# Altium schematic sheet OneWifiGamePad.SchDoc
size A4; PageSetup: Record=PageOptions|CenterHorizontal=True|CenterVertical=True|PrintScale=0.71|XCorrection=1.00|YCorrection=1.00|PrintKind=1|BorderSize=5000000|LeftOffset=0|BottomOffset=0|Orientation=2|PaperLength=1000|PaperWidth=1000|Scale=100|PaperSource=15|PrintQuality=600|MediaType=1|DitherType=10|PaperKind=Statement|PrintScaleMode=1
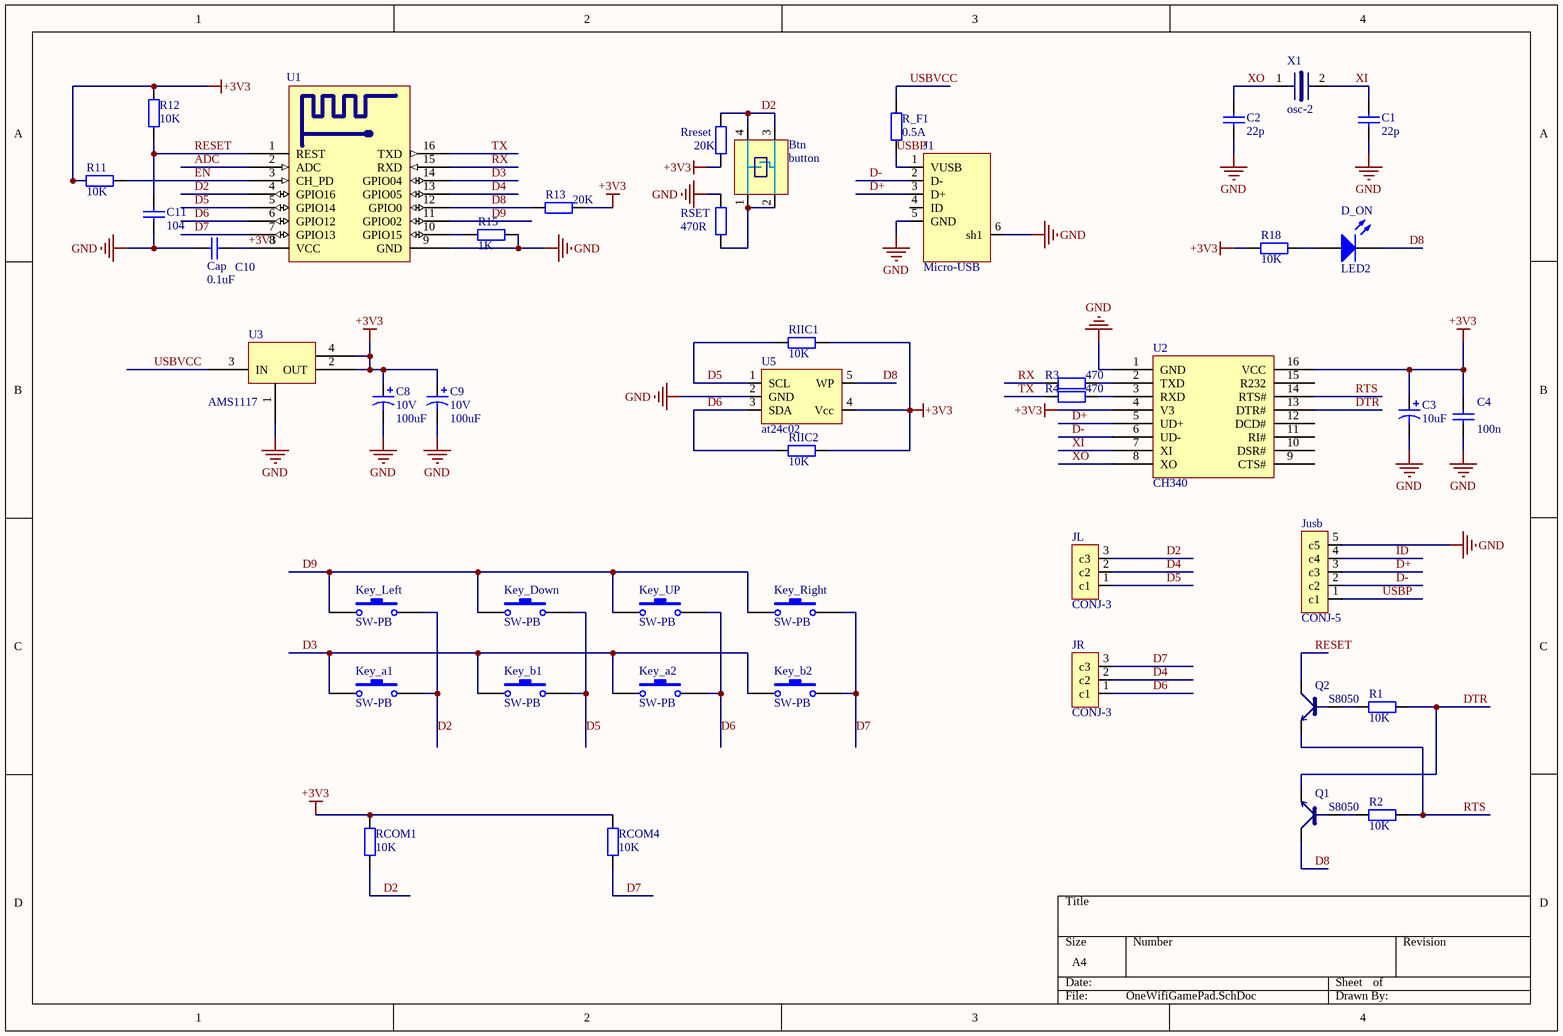
[diagram p0: OneWifiGamePad.SchDoc]

## Parts
Btn  button  [SW_6x6]
C1  22p  [0603]
C2  22p  [0603]
C3  10uF  [smd-ec-f5]
C4  100n  [0603]
C8  10V  value 100uF  [smd-ec-f5]
C9  10V  value 100uF  [smd-ec-f5]
C10  Cap  value 0.1uF  [0603]
C11  104  [0603]
D_ON  LED2  [0603]
J1  Micro-USB  [Micro_USB_B]
JL  CONJ-3  [sip-3]
JR  CONJ-3  [sip-3]
Jusb  CONJ-5  [sip-5]
Key_a1  SW-PB  [gamepad]
Key_a2  SW-PB  [gamepad]
Key_b1  SW-PB  [gamepad]
Key_b2  SW-PB  [gamepad]
Key_Down  SW-PB  [gamepad]
Key_Left  SW-PB  [GamePad]
Key_Right  SW-PB  [gamepad]
Key_UP  SW-PB  [gamepad]
Q1  S8050  [sot23-3]
Q2  S8050  [sot23-3]
R1  10K  [0603]
R2  10K  [0603]
R3  470  [0603]
R4  470  [0603]
R11  10K  [0603]
R12  10K  [0603]
R13  20K  [0603]
R15  1K  [0603]
R18  10K  [0603]
R_F1  0.5A  [0805]
RCOM1  value 10K  [0603]  (hidden comment: Res2)
RCOM4  value 10K  [0603]  (hidden comment: Res2)
RIIC1  10k  [0603]
RIIC2  10k  [0603]
Rreset  value 20K  [0603]  (hidden comment: 10k)
RSET  value 470R  [0603]  (hidden comment: Res2)
U1  ESP-12  [ESP_12]  (value not drawn)
U2  CH340  [SOP127P762-16M]
U3  AMS1117  [SOT-223]
U5  at24c02  [sot-23-5]
X1  osc-2  [RAD-0.2]

## Nets
+3V3: C3.1 C4.2 C8.1 C9.1 C10.1 R11.1 R12.2 R13.2 R18.1 RCOM1.2 RCOM4.2 RIIC1.1 RIIC2.1 Rreset.1 U1.8(VCC) U2.4(V3) U2.16(VCC) U3.2(OUT) U3.4(p4) U5.4(Vcc)
GND: C1.1 C2.1 C3.2 C4.1 C8.2 C9.2 C10.2 C11.1 J1.5(GND) J1.6(sh1) Jusb.5(c5) R15.2 RSET.2 U1.9(GND) U2.1(GND) U3.1(p1) U5.2(GND)
ADC: U1.2(ADC)
D2: Btn.3(b2) Btn.4(a2) JL.3(c3) Key_a1.2 Key_Left.2 RCOM1.1 Rreset.2 U1.4(GPIO16)
D3: Key_a1.1 Key_a2.1 Key_b1.1 Key_b2.1 U1.14(GPIO04)
D4: JL.2(c2) JR.2(c2) U1.13(GPIO05)
D5: JL.1(c1) Key_b1.2 Key_Down.2 RIIC1.2 U1.5(GPIO14) U5.1(SCL)
D6: JR.1(c1) Key_a2.2 Key_UP.2 RIIC2.2 U1.6(GPIO12) U5.3(SDA)
D7: JR.3(c3) Key_b2.2 Key_Right.2 RCOM4.1 U1.7(GPIO13)
D8: D_ON.2(K) Q1.3 R13.1 U1.12(GPIO0) U5.5(WP)
D9: Key_Down.1 Key_Left.1 Key_Right.1 Key_UP.1 U1.11(GPIO02)
D+: J1.3(D+) Jusb.3(c3) U2.5(UD+)
D-: J1.2(D-) Jusb.2(c2) U2.6(UD-)
DTR: Q1.2 R1.2 U2.13(DTR#)
EN: R11.2 U1.3(CH_PD)
ID: Jusb.4(c4)
RESET: C11.2 Q2.3 R12.1 U1.1(REST)
RTS: Q2.2 R2.2 U2.14(RTS#)
RX: R3.1 U1.15(RXD)
TX: R4.1 U1.16(TXD)
USBP: J1.1(VUSB) Jusb.1(c1) R_F1.1
USBVCC: R_F1.2 U3.3(IN)
XI: C1.2 U2.7(XI) X1.2(c7)
XO: C2.2 U2.8(XO) X1.1(c6)
NetBtn_1: Btn.1(a1) Btn.2(b1) RSET.1
NetD_ON_1: D_ON.1(A) R18.2
NetQ1_1: Q1.1 R2.1
NetQ2_1: Q2.1 R1.1
NetR3_2: R3.2 U2.2(TXD)
NetR4_2: R4.2 U2.3(RXD)
NetR15_1: R15.1 U1.10(GPIO15)

Not connected (* = marked no-connect by the designer): J1 4(ID); U2 9(CTS#) 10(DSR#) 11(RI#) 12(DCD#) 15(R232)

## Library data of the parts
C1 C2 = Cap: Capacitor; Value: 0.01uF; Published: 8-Jun-2000; LatestRevisionDate: 17-Jul-2002; LatestRevisionNote: Re-released for DXP Platform.; PackageReference: RAD-0.3; Publisher: Altium Limited
C3 C8 C9 = Cap Pol1: Polarized Capacitor (Radial); Published: 8-Jun-2000; LatestRevisionDate: 17-Jul-2002; LatestRevisionNote: Re-released for DXP Platform.; PackageReference: RB7.6-15; Publisher: Altium Limited
  C3: Value: 10uF
C4 C11 = Cap: Capacitor; Value: 0.1uF; Published: 8-Jun-2000; LatestRevisionDate: 17-Jul-2002; LatestRevisionNote: Re-released for DXP Platform.; PackageReference: RAD-0.3; Publisher: Altium Limited
C10 = Cap: Capacitor; Published: 8-Jun-2000; LatestRevisionDate: 17-Jul-2002; LatestRevisionNote: Re-released for DXP Platform.; PackageReference: RAD-0.3; Publisher: Altium Limited
D_ON = LED2: Typical RED, GREEN, YELLOW, AMBER GaAs LED; Published: 8-Jun-2000; LatestRevisionDate: 17-Jul-2002; LatestRevisionNote: Re-released for DXP Platform.; PackageVersion: Feb-2002; PackageReference: 3.2X1.6X1.1; Publisher: Altium Limited
Key_a1 Key_a2 Key_b1 Key_b2 Key_Down Key_Left Key_Right Key_UP = SW-PB: Switch; Published: 24-Mar-1999; LatestRevisionDate: 17-Jul-2002; LatestRevisionNote: Re-released for DXP Platform.; PackageReference: SPST-2; Publisher: Altium Limited
Q1 Q2 = NPN_23-3
R1 R2 R11 R12 R18 RCOM1 RCOM4 RIIC1 RIIC2 Rreset RSET = Res2: Resistor; Published: 8-Jun-2000; LatestRevisionDate: 17-Jul-2002; LatestRevisionNote: Re-released for DXP Platform.; PackageReference: AXIAL-0.4; Publisher: Altium Limited
  R1 R2 R11 R12 R18 RIIC1 RIIC2: Value: 10K
R3 R4 R_F1 = Res2: Resistor; Value: 1K; Published: 8-Jun-2000; LatestRevisionDate: 17-Jul-2002; LatestRevisionNote: Re-released for DXP Platform.; PackageReference: AXIAL-0.4; Publisher: Altium Limited
R13 R15 = Res2: Resistor; Value: 10K; Published: 8-Jun-2000; LatestRevisionDate: 17-Jul-2002; LatestRevisionNote: Re-released for DXP Platform.; PackageReference: AXIAL-0.4; Publisher: Altium Limited
U2 = RS232